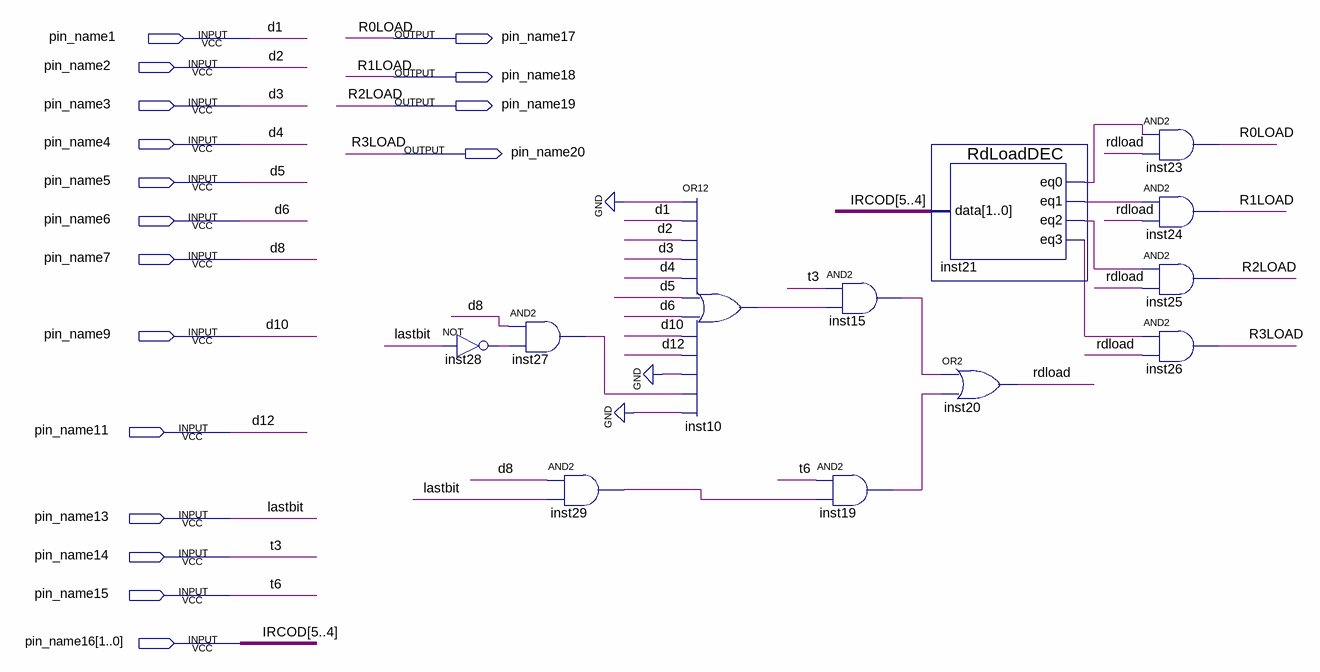
[diagram p0: schematic sheet]
// Quartus schematic Block3.bdf as structural Verilog: 12 symbols, 17 pins
module Block3 (
  input  pin_name1,
  input  pin_name2,
  input  pin_name3,
  input  pin_name4,
  input  pin_name5,
  input  pin_name6,
  input  pin_name7,
  input  pin_name9,
  input  pin_name11,
  input  pin_name13,
  input  pin_name14,
  input  pin_name15,
  input  [1:0] pin_name16,
  output pin_name17,
  output pin_name18,
  output pin_name19,
  output pin_name20
);

  wire inst10_out, inst15_out, inst19_out, inst21_eq0, inst21_eq1, inst21_eq2, inst21_eq3, inst27_out,
       inst28_out, inst29_out, rdload;

  not inst28 (inst28_out, pin_name13);
  and inst27 (inst27_out, pin_name7, inst28_out);
  and inst29 (inst29_out, pin_name7, pin_name13);
  or inst10 (inst10_out, 1'b0, pin_name1, pin_name2, pin_name3, pin_name4, pin_name5, pin_name6, pin_name9, pin_name11, 1'b0, inst27_out, 1'b0);
  and inst15 (inst15_out, pin_name14, inst10_out);
  and inst19 (inst19_out, pin_name15, inst29_out);
  RdLoadDEC inst21 (.data(pin_name16), .eq0(inst21_eq0), .eq1(inst21_eq1), .eq2(inst21_eq2), .eq3(inst21_eq3));
  or inst20 (rdload, inst15_out, inst19_out);
  and inst23 (pin_name17, inst21_eq0, rdload);
  and inst24 (pin_name18, inst21_eq1, rdload);
  and inst25 (pin_name19, inst21_eq2, rdload);
  and inst26 (pin_name20, inst21_eq3, rdload);

  // Other names for the same wires on the sheet: d1 = pin_name1; d2 = pin_name2; d3 = pin_name3; d4 = pin_name4;
  //   d5 = pin_name5; d6 = pin_name6; d8 = pin_name7; d10 = pin_name9; d12 = pin_name11; IRCOD[5:4] = pin_name16;
  //   lastbit = pin_name13; R0LOAD = pin_name17; R1LOAD = pin_name18; R2LOAD = pin_name19; R3LOAD = pin_name20;
  //   t3 = pin_name14; t6 = pin_name15
endmodule
